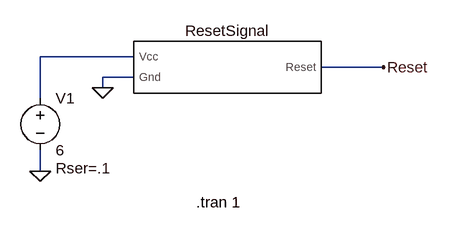
[diagram p0: schematic Mod2_ResetSignal_Test.asc]
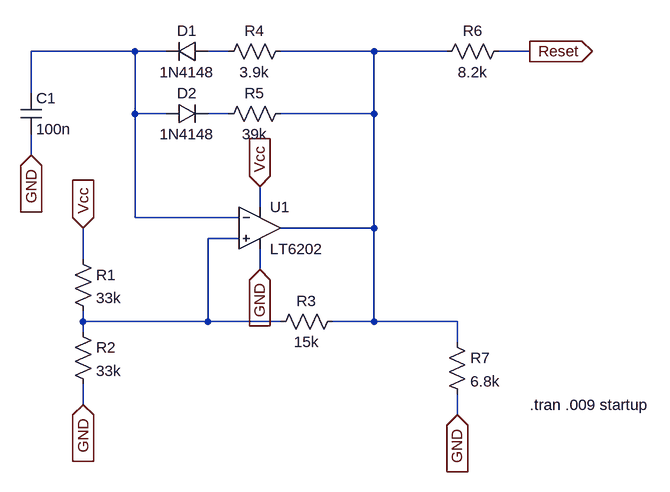
[diagram p1: sub-circuit mod2_resetsignal.asc]
Mod2_ResetSignal_Test.asc, the LTspice schematic file:
Version 4.1
SHEET 1 880 680
WIRE 80 144 -64 144
WIRE 464 160 368 160
WIRE 80 176 32 176
WIRE 32 192 32 176
WIRE -64 208 -64 144
WIRE -64 320 -64 288
FLAG -64 320 0
FLAG 32 192 0
FLAG 464 160 Reset
SYMBOL voltage -64 192 R0
WINDOW 123 0 0 Left 0
WINDOW 39 24 124 Left 2
SYMATTR SpiceLine Rser=.1
SYMATTR InstName V1
SYMATTR Value 6
SYMBOL Mod2_ResetSignal 224 160 R0
SYMATTR InstName ResetSignal
TEXT 176 368 Left 2 !.tran 1

mod2_resetsignal.asc, the sub-circuit schematic file:
Version 4.1
SHEET 1 880 784
WIRE -272 112 -432 112
WIRE -224 112 -272 112
WIRE -128 112 -160 112
WIRE 96 112 -48 112
WIRE 208 112 96 112
WIRE 336 112 288 112
WIRE -432 176 -432 112
WIRE -272 208 -272 112
WIRE -224 208 -272 208
WIRE -128 208 -160 208
WIRE 96 208 96 112
WIRE 96 208 -48 208
WIRE -432 272 -432 240
WIRE -80 352 -80 320
WIRE -272 368 -272 208
WIRE -112 368 -272 368
WIRE 96 384 96 208
WIRE 96 384 -48 384
WIRE -112 400 -160 400
WIRE -352 432 -352 384
WIRE -80 448 -80 416
WIRE -352 528 -352 512
WIRE -160 528 -160 400
WIRE -160 528 -352 528
WIRE -48 528 -160 528
WIRE 96 528 96 384
WIRE 96 528 32 528
WIRE 224 528 96 528
WIRE -352 544 -352 528
WIRE 224 560 224 528
WIRE -352 656 -352 624
WIRE 224 672 224 640
FLAG -80 320 Vcc
IOPIN -80 320 In
FLAG -352 384 Vcc
IOPIN -352 384 In
FLAG 224 672 GND
IOPIN 224 672 In
FLAG -352 656 GND
IOPIN -352 656 In
FLAG -80 448 GND
IOPIN -80 448 In
FLAG -432 272 GND
IOPIN -432 272 In
FLAG 336 112 Reset
IOPIN 336 112 Out
SYMBOL res -368 416 R0
SYMATTR InstName R1
SYMATTR Value 33k
SYMBOL res -368 528 R0
SYMATTR InstName R2
SYMATTR Value 33k
SYMBOL res 48 512 R90
WINDOW 0 0 56 VBottom 2
WINDOW 3 32 56 VTop 2
SYMATTR InstName R3
SYMATTR Value 15k
SYMBOL res -32 96 R90
WINDOW 0 0 56 VBottom 2
WINDOW 3 32 56 VTop 2
SYMATTR InstName R4
SYMATTR Value 3.9k
SYMBOL res -32 192 R90
WINDOW 0 0 56 VBottom 2
WINDOW 3 32 56 VTop 2
SYMATTR InstName R5
SYMATTR Value 39k
SYMBOL res 304 96 R90
WINDOW 0 0 56 VBottom 2
WINDOW 3 32 56 VTop 2
SYMATTR InstName R6
SYMATTR Value 8.2k
SYMBOL cap -448 176 R0
SYMATTR InstName C1
SYMATTR Value 100n
SYMBOL diode -160 96 R90
WINDOW 0 0 32 VBottom 2
WINDOW 3 32 32 VTop 2
SYMATTR InstName D1
SYMATTR Value 1N4148
SYMBOL diode -224 224 R270
WINDOW 0 32 32 VTop 2
WINDOW 3 0 32 VBottom 2
SYMATTR InstName D2
SYMATTR Value 1N4148
SYMBOL res 208 544 R0
SYMATTR InstName R7
SYMATTR Value 6.8k
SYMBOL OpAmps\\LT6202 -80 384 R0
SYMATTR InstName U1
TEXT 336 656 Left 2 !.tran .009 startup

The netlist it stands for:
* Mod2_ResetSignal_Test.asc
V1 N001 0 6 Rser=.1
X§ResetSignal N001 0 Reset mod2_resetsignal

* block symbol definitions
.subckt mod2_resetsignal Vcc Gnd Reset
R1 Vcc N005 33k
R2 N005 GND 33k
R3 N003 N005 15k
R4 N003 N002 3.9k
R5 N003 N004 39k
R6 Reset N003 8.2k
C1 N001 GND 100n
D1 N002 N001 1N4148
D2 N001 N004 1N4148
R7 N003 GND 6.8k
* U1: LT6202 (symbol OpAmps\LT6202 not available, pins judged from their places): In+=N005 In-=N001 V+=Vcc V-=GND OUT=N003
.tran .009 startup
.ends mod2_resetsignal

.model D D
.lib standard.dio
.tran 1
.backanno
.end